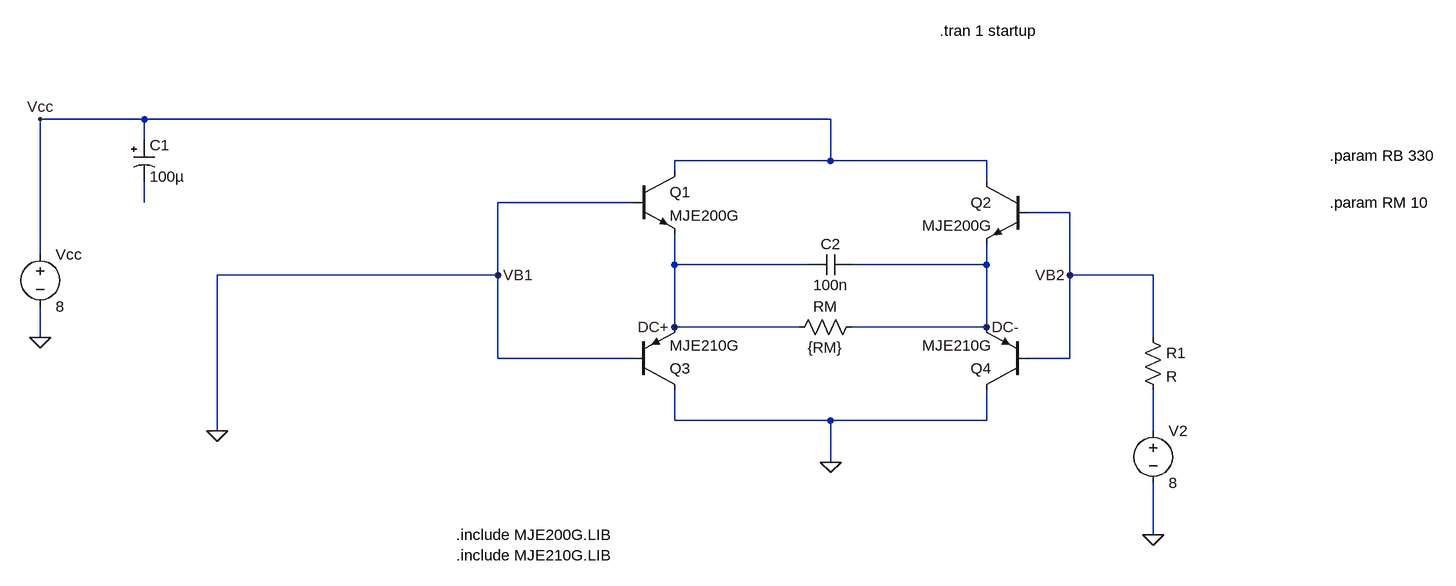
[diagram p0: schematic Backward Direction.asc]
Backward Direction.asc, the LTspice schematic file:
Version 4
SHEET 1 1376 684
WIRE -640 -32 -800 -32
WIRE 416 -32 -640 -32
WIRE -640 0 -640 -32
WIRE 416 32 416 -32
WIRE 416 32 176 32
WIRE 656 32 416 32
WIRE 176 48 176 32
WIRE 656 64 656 32
WIRE -640 96 -640 64
WIRE 112 96 -96 96
WIRE 784 112 720 112
WIRE -800 176 -800 -32
WIRE 176 192 176 144
WIRE 384 192 176 192
WIRE 656 192 656 160
WIRE 656 192 448 192
WIRE -96 208 -96 96
WIRE -96 208 -528 208
WIRE 784 208 784 112
WIRE 912 208 784 208
WIRE 176 288 176 192
WIRE 368 288 176 288
WIRE 656 288 656 192
WIRE 656 288 448 288
WIRE -800 304 -800 256
WIRE 912 304 912 208
WIRE -96 336 -96 208
WIRE 112 336 -96 336
WIRE 784 336 784 208
WIRE 784 336 720 336
WIRE 176 432 176 384
WIRE 416 432 176 432
WIRE 656 432 656 384
WIRE 656 432 416 432
WIRE -528 448 -528 208
WIRE 912 448 912 384
WIRE 416 496 416 432
WIRE 912 608 912 528
FLAG 416 496 0
FLAG -528 448 0
FLAG -800 304 0
FLAG -800 -32 Vcc
FLAG 784 208 VB2
FLAG 176 288 DC+
FLAG 656 288 DC-
FLAG -96 208 VB1
FLAG 912 608 0
SYMBOL npn 112 48 R0
SYMATTR InstName Q1
SYMATTR Value MJE200G
SYMBOL voltage -800 160 R0
WINDOW 123 0 0 Left 0
WINDOW 39 0 0 Left 0
SYMATTR InstName Vcc
SYMATTR Value 8
SYMBOL polcap -656 0 R0
SYMATTR InstName C1
SYMATTR Value 100µ
SYMBOL pnp 720 384 R180
SYMATTR InstName Q4
SYMATTR Value MJE210G
SYMBOL npn 720 64 M0
SYMATTR InstName Q2
SYMATTR Value MJE200G
SYMBOL pnp 112 384 M180
SYMATTR InstName Q3
SYMATTR Value MJE210G
SYMBOL cap 448 176 R90
WINDOW 0 0 32 VBottom 2
WINDOW 3 32 32 VTop 2
SYMATTR InstName C2
SYMATTR Value 100n
SYMBOL res 352 304 R270
WINDOW 0 32 56 VTop 2
WINDOW 3 0 56 VBottom 2
SYMATTR InstName RM
SYMATTR Value {RM}
SYMBOL res 896 288 R0
SYMATTR InstName R1
SYMBOL voltage 912 432 R0
SYMATTR InstName V2
SYMATTR Value 8
TEXT -160 608 Left 2 !.include MJE200G.LIB\n.include MJE210G.LIB
TEXT 584 -168 Left 2 !.tran 1 startup
TEXT 1184 24 Left 2 !.param RB 330
TEXT 1184 96 Left 2 !.param RM 10

The netlist it stands for:
* Backward Direction.asc
Q1 Vcc 0 DC+ 0 MJE200G
Vcc Vcc 0 8
C1 Vcc N001 100µ
Q4 0 VB2 DC- 0 MJE210G
Q2 Vcc VB2 DC- 0 MJE200G
Q3 0 0 DC+ 0 MJE210G
C2 DC- DC+ 100n
RM DC+ DC- {RM}
R1 VB2 N002 R
V2 N002 0 8
.model NPN NPN
.model PNP PNP
.lib standard.bjt
.include MJE200G.LIB
.include MJE210G.LIB
.tran 1 startup
.param RB 330
.param RM 10
.backanno
.end